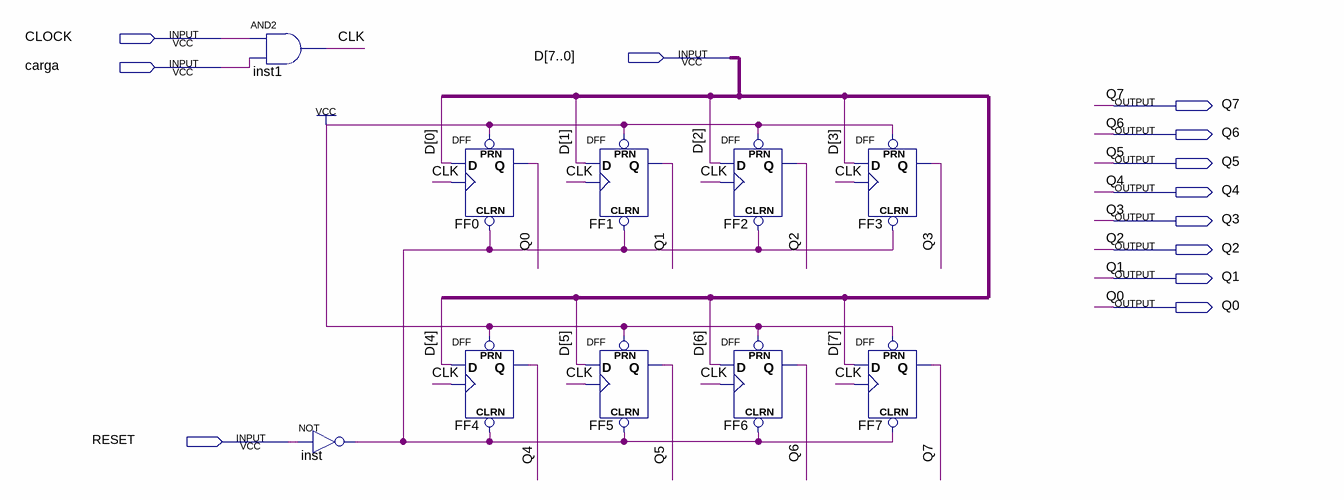
[diagram p0: schematic sheet]
// Quartus schematic Carga.bdf as structural Verilog: 10 symbols, 12 pins
module Carga (
  input  CLOCK,
  input  [7:0] D,
  input  carga,
  input  RESET,
  output Q7,
  output Q6,
  output Q5,
  output Q4,
  output Q3,
  output Q2,
  output Q1,
  output Q0
);

  wire CLK, inst_out;

  and inst1 (CLK, CLOCK, carga);
  not inst (inst_out, RESET);
  DFF FF0 (.CLRN(inst_out), .CLK(CLK), .D(D[0]), .PRN(1'b1), .Q(Q0));
  DFF FF4 (.CLRN(inst_out), .CLK(CLK), .D(D[4]), .PRN(1'b1), .Q(Q4));
  DFF FF1 (.CLRN(inst_out), .CLK(CLK), .D(D[1]), .PRN(1'b1), .Q(Q1));
  DFF FF5 (.CLRN(inst_out), .CLK(CLK), .D(D[5]), .PRN(1'b1), .Q(Q5));
  DFF FF2 (.CLRN(inst_out), .CLK(CLK), .D(D[2]), .PRN(1'b1), .Q(Q2));
  DFF FF6 (.CLRN(inst_out), .CLK(CLK), .D(D[6]), .PRN(1'b1), .Q(Q6));
  DFF FF3 (.CLRN(inst_out), .CLK(CLK), .D(D[3]), .PRN(1'b1), .Q(Q3));
  DFF FF7 (.CLRN(inst_out), .CLK(CLK), .D(D[7]), .PRN(1'b1), .Q(Q7));
endmodule
